# EAGLE design SlaveV2 (EAGLE 9.5.1)
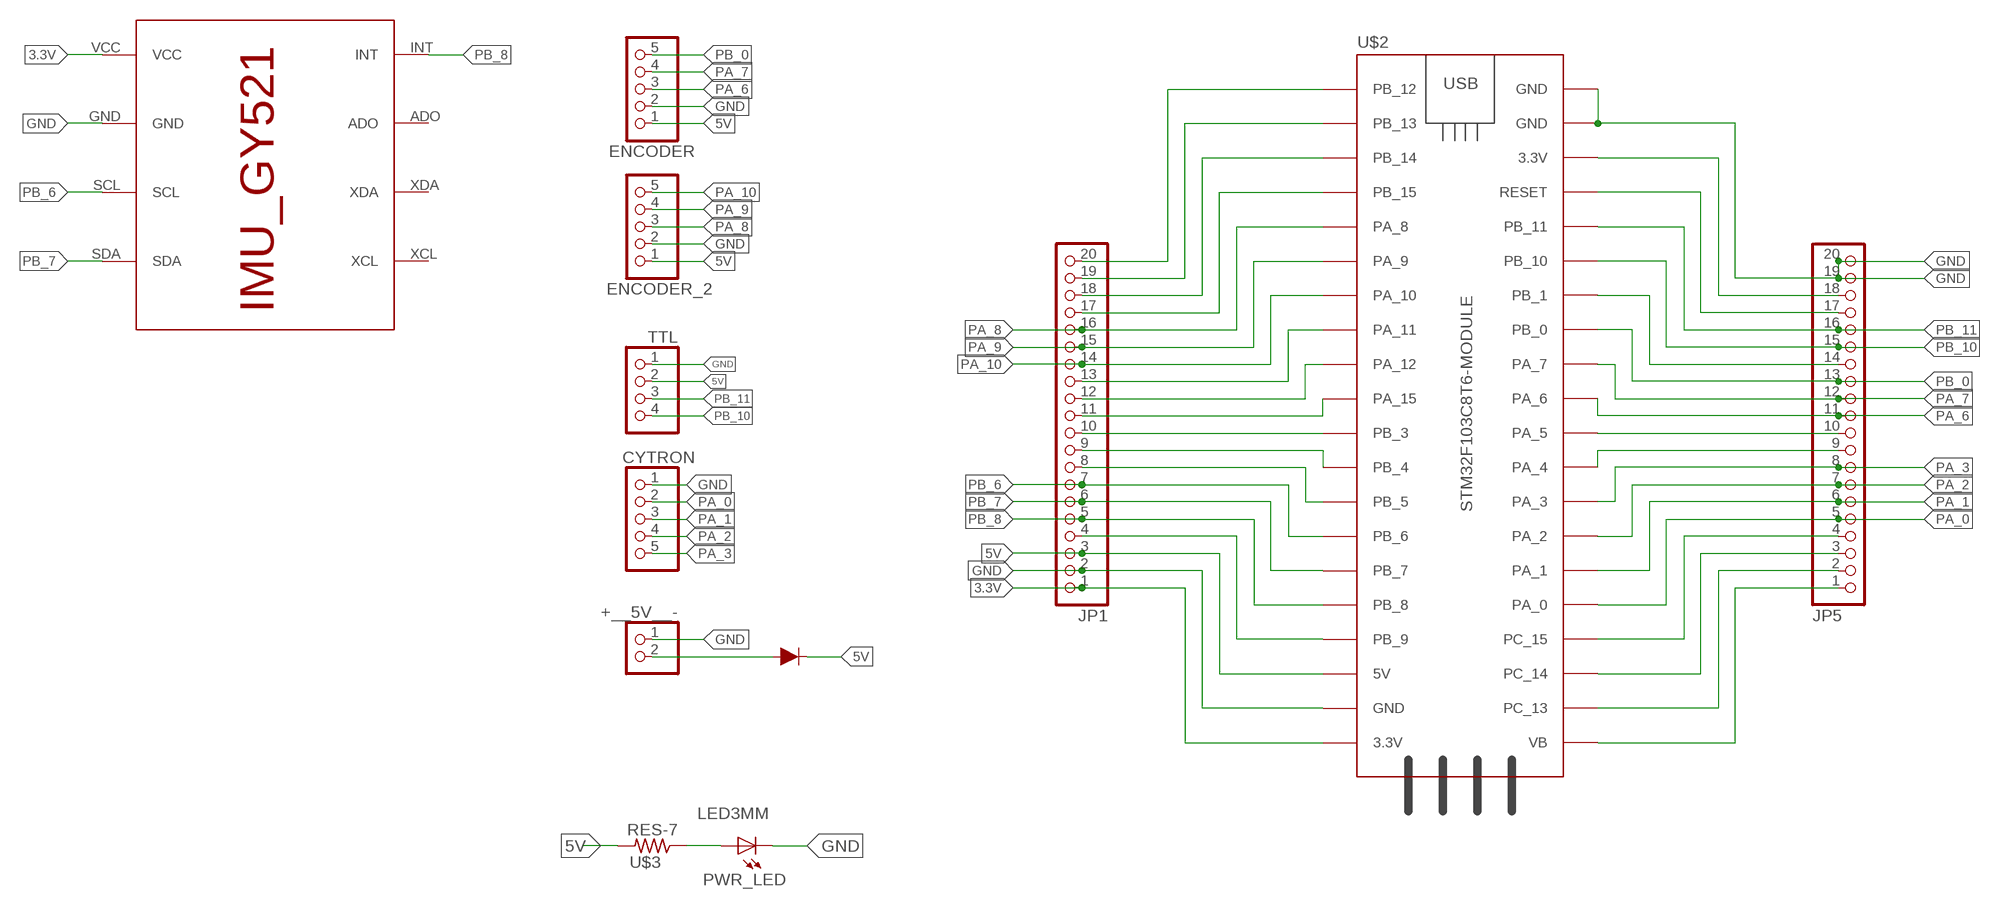
[diagram p0: schematic, sheet 1]

## Parts
+__5V__-  PINHD-2_DATA  [1X02_DATA]
CYTRON  PINHD-5_DATA  [1X05_DATA]
D1  200mA/100V/1V  DIODE(1A)-1N4148  [DIODE-1N4148]
ENCODER  PINHD-5_DATA  [1X05_DATA]
ENCODER_2  PINHD-5_DATA  [1X05_DATA]
IMU  IMU_ROBOCON_GY521  [IMU_GY521]
JP1  PINHD-1X20  [1X20]
JP5  PINHD-1X20  [1X20]
PWR_LED  LED3MM  [LED3MM]
TTL  PINHD-4_DATA  [1X04_DATA]
U$2  STM32F103C8T6-MODULE  [STM32F103C8T6-MODULE]
U$3  RES-7  [0204/7]

## Nets
3.3V: IMU.VCC JP1.1 U$2.3.3V_1(3.3V)
3.3V_2: JP5.18 U$2.3.3V_2(3.3V)
5V: D1.C ENCODER.1 ENCODER_2.1 JP1.3 TTL.2 U$2.5V U$3.2
A: PWR_LED.A U$3.1
GND: +__5V__-.1 CYTRON.1 ENCODER.2 ENCODER_2.2 IMU.GND JP1.2 JP5.19 JP5.20 PWR_LED.K(C) TTL.1 U$2.GND_1(GND) U$2.GND_2(GND) U$2.GND_3(GND)
N$1: JP1.10 U$2.PB_3
N$2: JP1.11 U$2.PA_15
N$3: JP1.12 U$2.PA_12
N$4: JP1.13 U$2.PA_11
N$8: JP1.17 U$2.PB_15
N$9: JP1.18 U$2.PB_14
N$10: JP1.19 U$2.PB_13
N$11: JP1.20 U$2.PB_12
N$12: JP1.9 U$2.PB_4
N$13: JP1.8 U$2.PB_5
N$17: JP1.4 U$2.PB_9
N$21: JP5.10 U$2.PA_5
N$25: JP5.14 U$2.PB_1
N$28: JP5.17 U$2.RESET
N$29: +__5V__-.2 D1.A
N$32: JP5.9 U$2.PA_4
N$37: JP5.4 U$2.PC_15
N$38: JP5.3 U$2.PC_14
N$39: JP5.2 U$2.PC_13
N$40: JP5.1 U$2.VB
PA_0: CYTRON.2 JP5.5 U$2.PA_0
PA_1: CYTRON.3 JP5.6 U$2.PA_1
PA_2: CYTRON.4 JP5.7 U$2.PA_2
PA_3: CYTRON.5 JP5.8 U$2.PA_3
PA_6: ENCODER.3 JP5.11 U$2.PA_6
PA_7: ENCODER.4 JP5.12 U$2.PA_7
PA_8: ENCODER_2.3 JP1.16 U$2.PA_8
PA_9: ENCODER_2.4 JP1.15 U$2.PA_9
PA_10: ENCODER_2.5 JP1.14 U$2.PA_10
PB_0: ENCODER.5 JP5.13 U$2.PB_0
PB_6: IMU.SCL JP1.7 U$2.PB_6
PB_7: IMU.SDA JP1.6 U$2.PB_7
PB_8: IMU.INT JP1.5 U$2.PB_8
PB_10: JP5.15 TTL.4 U$2.PB_10
PB_11: JP5.16 TTL.3 U$2.PB_11
Unconnected: IMU.ADO IMU.XCL IMU.XDA

## Library data of the parts
+__5V__- = MIA_LIBRARY-2-2-2:PINHD-2_DATA: PIN HEADER
CYTRON ENCODER ENCODER_2 = MIA_LIBRARY-2-2-2:PINHD-5_DATA: PIN HEADER
D1 = MIA_LIBRARY-2-2-2:DIODE(1A): Diode These are standard reverse protection diodes and small signal diodes. SparkFun Products: SparkFun SparkPunk Sound Kit <https://www.sparkfun.com/products/11177> SparkFun ESP8266 Thing <https://www.sparkfun.com/products/13231>; PROD_ID: DIO-08378
IMU = MIA_LIBRARY-2-2-2:IMU_ROBOCON_GY521
JP1 JP5 = MIA_LIBRARY-2-2-2:PINHD-1X20: PIN HEADER
PWR_LED = MIA_LIBRARY-2-2-2:LED3MM
TTL = MIA_LIBRARY-2-2-2:PINHD-4_DATA: PIN HEADER
U$2 = MIA_LIBRARY-2-2-2:STM32F103C8T6-MODULE: STM32F103C8T6 module with ARM Cortex-3, 20kB SRAM, 64kB Flash, 72MHz
U$3 = MIA_LIBRARY-2-2-2:RES-7

## Board
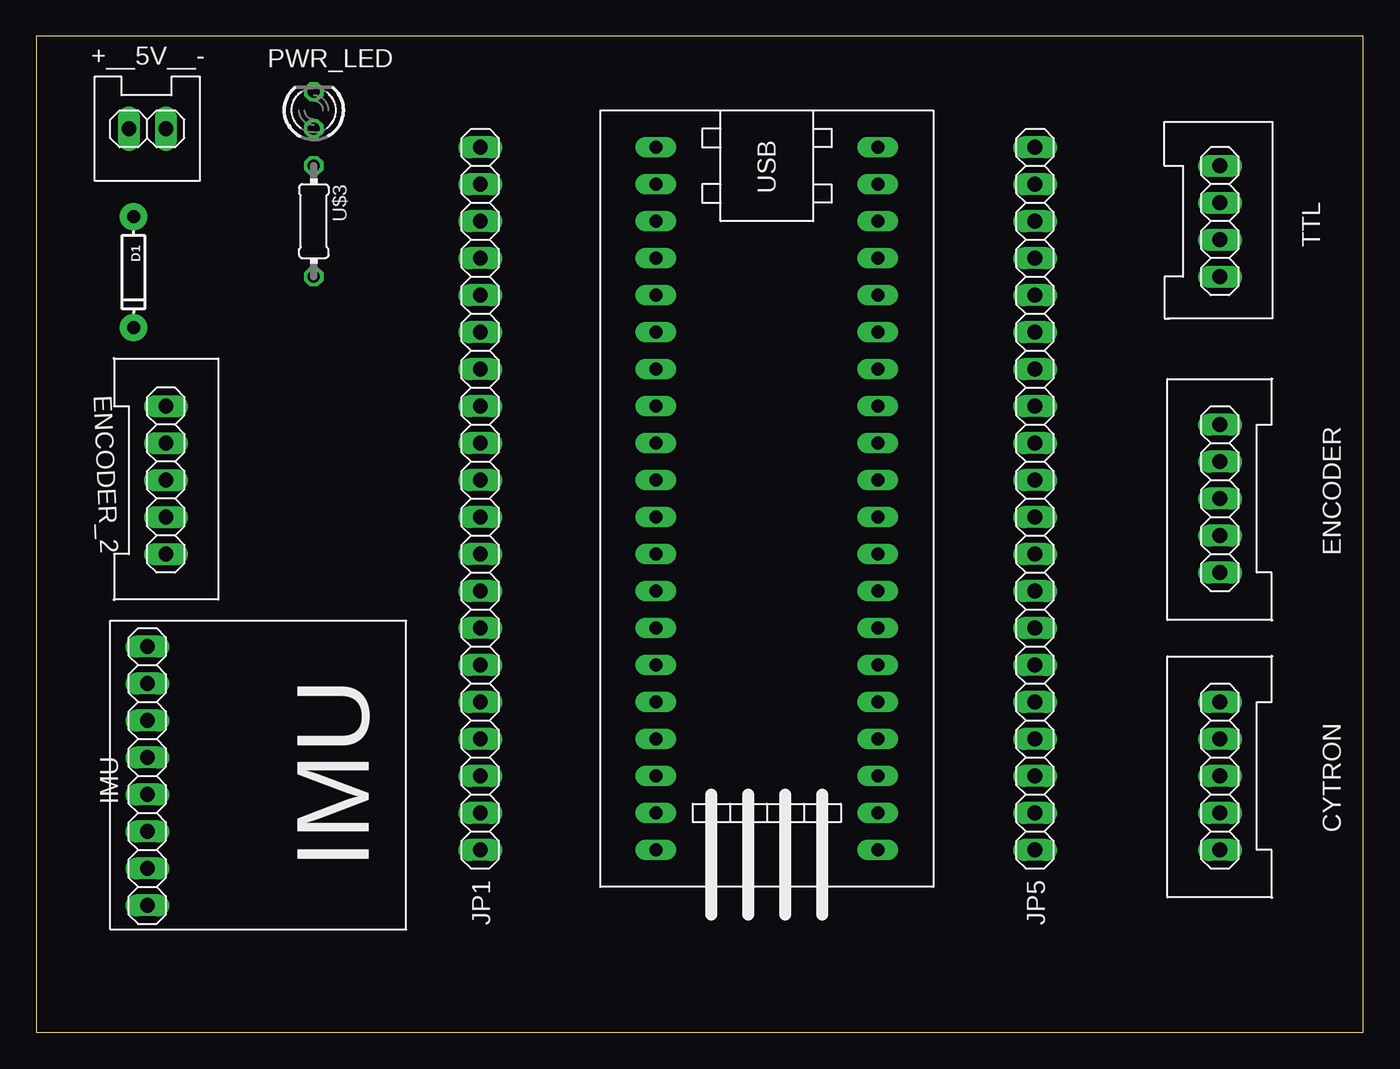
[diagram p1: board, top side]
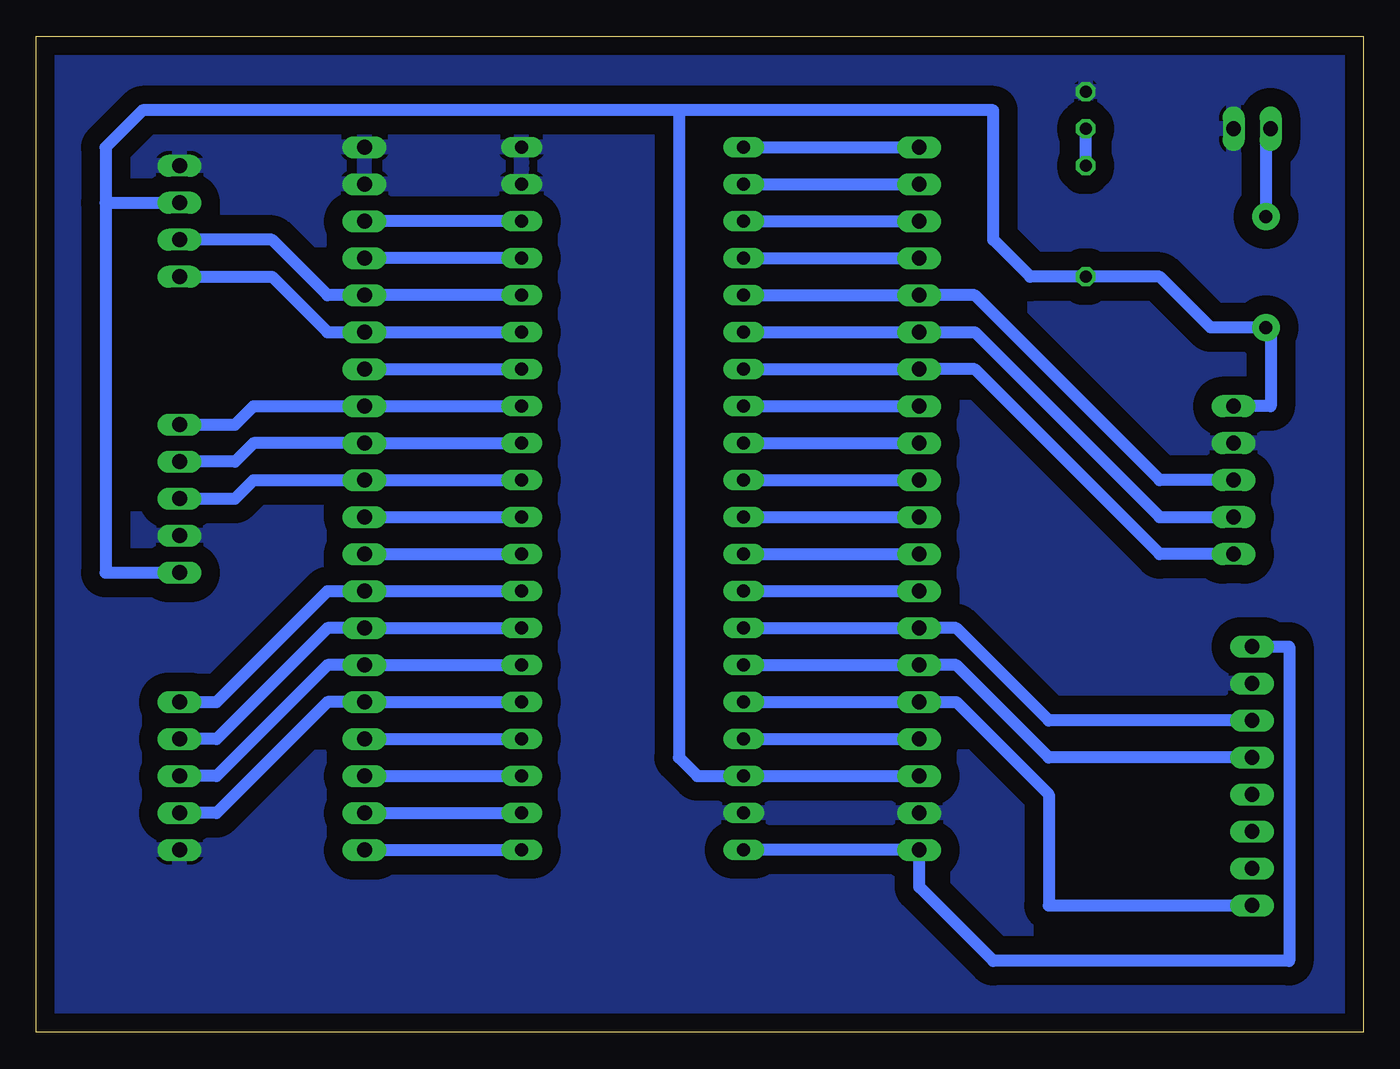
[diagram p2: board, bottom side, seen from below]

Size 91.11 x 68.41 mm. Coordinates in mm from the lower left corner, seen from the top.
Outline: 0,0 91.11,0 91.11,68.41 0,68.41 0,0
Copper layers (1*16): Top 0.035mm / dielectric 1.5mm / Bottom 0.035mm
Design rules "default": minimum track width 6mil, minimum drill 0.35mm, track to track 6mil, track to pad 6mil, pad to pad 6mil, via to via 6mil, smd to smd 6mil, copper to edge 40mil, drill to drill 6mil, minimum pad ring 10mil, minimum via ring 8mil, stop-mask expansion 4mil, vias tented up to drill 0mil, thermal gap 10mil

### Footprints (pad centres in the part's own frame; a part is rotated, then mirrored left to right if it is on the bottom)
1X02_DATA = drill 1.016 long: 1 -1.27,0; 2 1.27,0
1X05_DATA = drill 1.016 long: 1 -5.08,0; 2 -2.54,0; 3 0,0; 4 2.54,0; 5 5.08,0
DIODE-1N4148 = drill 0.9 pad 1.88: A -3.81,0; C 3.81,0
IMU_GY521 = drill 1.016 long: ADO -6.35,0; GND 6.35,0; INT -8.89,0; SCL 3.81,0; SDA 1.27,0; VCC 8.89,0; XCL -3.81,0; XDA -1.27,0
1X20 = drill 1.016 long: 1 -24.13,0; 2 -21.59,0; 3 -19.05,0; 4 -16.51,0; 5 -13.97,0; 6 -11.43,0; 7 -8.89,0; 8 -6.35,0; 9 -3.81,0; 10 -1.27,0; 11 1.27,0; 12 3.81,0; 13 6.35,0; 14 8.89,0; 15 11.43,0; 16 13.97,0; 17 16.51,0; 18 19.05,0; 19 21.59,0; 20 24.13,0
LED3MM = drill 0.813 octagon: A -1.27,0; K 1.27,0
1X04_DATA = drill 1.016 long: 1 -3.81,0; 2 -1.27,0; 3 1.27,0; 4 3.81,0
STM32F103C8T6-MODULE = drill 0.9 long: 3.3V_1 25.4,-7.62; 3.3V_2 -17.78,7.62; 5V 20.32,-7.62; GND_1 22.86,-7.62; GND_2 -20.32,7.62; GND_3 -22.86,7.62; PA_0 15.24,7.62; PA_1 12.7,7.62; PA_2 10.16,7.62; PA_3 7.62,7.62; PA_4 5.08,7.62; PA_5 2.54,7.62; PA_6 0,7.62; PA_7 -2.54,7.62; PA_8 -12.7,-7.62; PA_9 -10.16,-7.62; PA_10 -7.62,-7.62; PA_11 -5.08,-7.62; PA_12 -2.54,-7.62; PA_15 0,-7.62; PB_0 -5.08,7.62; PB_1 -7.62,7.62; PB_3 2.54,-7.62; PB_4 5.08,-7.62; PB_5 7.62,-7.62; PB_6 10.16,-7.62; PB_7 12.7,-7.62; PB_8 15.24,-7.62; PB_9 17.78,-7.62; PB_10 -10.16,7.62; PB_11 -12.7,7.62; PB_12 -22.86,-7.62; PB_13 -20.32,-7.62; PB_14 -17.78,-7.62; PB_15 -15.24,-7.62; PC_13 22.86,7.62; PC_14 20.32,7.62; PC_15 17.78,7.62; RESET -15.24,7.62; VB 25.4,7.62
0204/7 = drill 0.813 octagon: 1 -3.81,0; 2 3.81,0

### Placement (x,y rotation side)
+__5V__-  7.62,62.07 180 top
CYTRON  81.28,17.62 90 top
D1  6.67,52.22 270 top
ENCODER  81.28,36.67 90 top
ENCODER_2  8.89,37.94 270 top
IMU  7.62,17.62 90 top
JP1  30.48,36.67 90 top
JP5  68.58,36.67 90 top
PWR_LED  19.05,63.34 90 top
TTL  81.28,55.72 270 top
U$2  50.16,37.94 270 top
U$3  19.05,55.72 270 top

### Tracks (layer width: path | path; a pad name or v marks a point on that pad's centre or on a via)
3.3V
  Bottom 0.813: IMU.VCC 5.08,26.51 5.08,4.92 25.4,4.92 30.48,10 JP1.1 U$2.3.3V_1
3.3V_2
  Bottom 0.813: U$2.3.3V_2 JP5.18
5V
  Bottom 0.813: ENCODER_2.1 6.35,43.02 6.35,48.09 D1.C 10.47,48.41 13.97,51.91 U$3.2 22.86,51.91 25.4,54.45 25.4,63.34 46.99,63.34 | 46.99,63.34 83.82,63.34 86.36,60.8 86.36,56.99 | 86.36,56.99 TTL.2 | 86.36,56.99 86.36,31.59 ENCODER.1 | 46.99,63.34 46.99,18.89 45.72,17.62 U$2.5V JP1.3
A
  Bottom 0.813: U$3.1 PWR_LED.A
GND
  pour Bottom (isolate 1.27): 0,68.42 91.44,68.42 91.44,-0.16 0,-0.16
N$1
  Bottom 0.813: U$2.PB_3 41.84,35.4 31.24,35.4 JP1.10
N$2
  Bottom 0.813: U$2.PA_15 41.84,37.94 31.24,37.94 JP1.11
N$3
  Bottom 0.813: U$2.PA_12 41.84,40.48 31.24,40.48 JP1.12
N$4
  Bottom 0.813: U$2.PA_11 41.84,43.02 31.24,43.02 JP1.13
N$8
  Bottom 0.813: U$2.PB_15 41.84,53.18 31.24,53.18 JP1.17
N$9
  Bottom 0.813: U$2.PB_14 41.84,55.72 31.24,55.72 JP1.18
N$10
  Bottom 0.813: U$2.PB_13 41.84,58.26 31.24,58.26 JP1.19
N$11
  Bottom 0.813: U$2.PB_12 41.84,60.8 31.24,60.8 JP1.20
N$12
  Bottom 0.813: U$2.PB_4 41.84,32.86 31.24,32.86 JP1.9
N$13
  Bottom 0.813: U$2.PB_5 41.84,30.32 31.24,30.32 JP1.8
N$17
  Bottom 0.813: U$2.PB_9 41.84,20.16 31.24,20.16 JP1.4
N$21
  Bottom 0.813: JP5.10 67.82,35.4 58.48,35.4 U$2.PA_5
N$25
  Bottom 0.813: JP5.14 67.82,45.56 58.48,45.56 U$2.PB_1
N$28
  Bottom 0.813: U$2.RESET JP5.17
N$29
  Bottom 0.813: +__5V__-.2 6.67,61.75 D1.A
N$32
  Bottom 0.813: JP5.9 67.82,32.86 58.48,32.86 U$2.PA_4
N$37
  Bottom 0.813: JP5.4 67.82,20.16 58.48,20.16 U$2.PC_15
N$38
  Bottom 0.813: JP5.3 67.82,17.62 58.48,17.62 U$2.PC_14
N$39
  Bottom 0.813: JP5.2 67.82,15.08 58.48,15.08 U$2.PC_13
N$40
  Bottom 0.813: JP5.1 67.82,12.54 58.48,12.54 U$2.VB
PA_0
  Bottom 0.813: CYTRON.2 78.74,15.08 71.12,22.7 JP5.5 67.82,22.7 58.48,22.7 U$2.PA_0
PA_1
  Bottom 0.813: CYTRON.3 78.74,17.62 71.12,25.24 JP5.6 67.82,25.24 58.48,25.24 U$2.PA_1
PA_2
  Bottom 0.813: CYTRON.4 78.74,20.16 71.12,27.78 JP5.7 67.82,27.78 58.48,27.78 U$2.PA_2
PA_3
  Bottom 0.813: CYTRON.5 78.74,22.7 71.12,30.32 JP5.8 67.82,30.32 58.48,30.32 U$2.PA_3
PA_6
  Bottom 0.813: ENCODER.3 77.47,36.67 76.2,37.94 JP5.11 67.82,37.94 58.48,37.94 U$2.PA_6
PA_7
  Bottom 0.813: ENCODER.4 77.47,39.21 76.2,40.48 JP5.12 67.82,40.48 58.48,40.48 U$2.PA_7
PA_8
  Bottom 0.813: ENCODER_2.3 13.97,37.94 26.67,50.64 JP1.16 U$2.PA_8
PA_9
  Bottom 0.813: ENCODER_2.4 13.97,35.4 26.67,48.1 JP1.15 U$2.PA_9
PA_10
  Bottom 0.813: ENCODER_2.5 13.97,32.86 26.67,45.56 JP1.14 U$2.PA_10
PB_0
  Bottom 0.813: ENCODER.5 77.47,41.75 76.2,43.02 JP5.13 67.82,43.02 58.48,43.02 U$2.PB_0
PB_6
  Bottom 0.813: IMU.SCL 21.59,21.43 27.94,27.78 JP1.7 U$2.PB_6
PB_7
  Bottom 0.813: IMU.SDA 21.59,18.89 27.94,25.24 JP1.6 U$2.PB_7
PB_8
  Bottom 0.813: IMU.INT 21.59,8.73 21.59,16.35 27.94,22.7 JP1.5 U$2.PB_8
PB_10
  Bottom 0.813: TTL.4 74.93,51.91 71.12,48.1 JP5.15 67.82,48.1 58.48,48.1 U$2.PB_10
PB_11
  Bottom 0.813: TTL.3 74.93,54.45 71.12,50.64 JP5.16 U$2.PB_11